# Altium project Sumobot 2007.PRJPCB
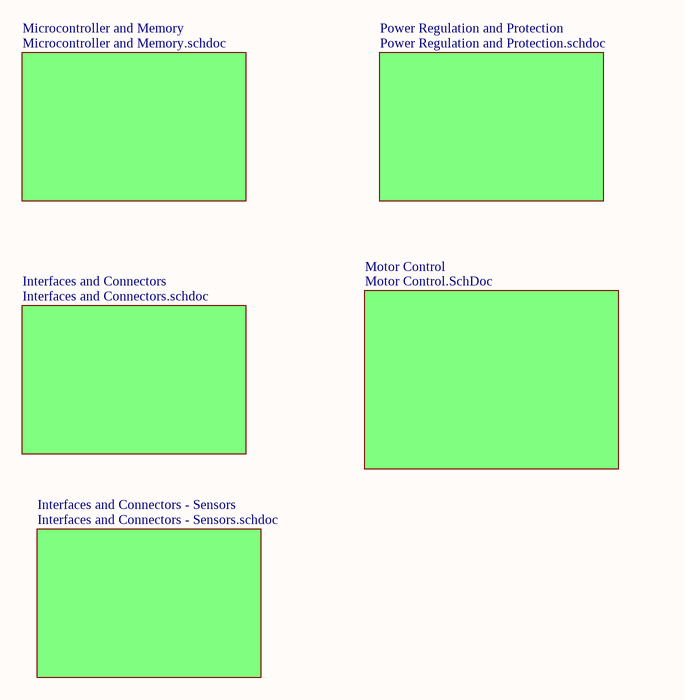
[diagram p0: Schematic of Schematics.SCHDOC]
6 sheets, 186 parts. Net scope: global (net labels, ports and power ports of the same name join across sheets).
Board files: PCB Layout.PCBDOC, SumoPCB.PcbDoc
Sheets:
  Schematic of Schematics.SCHDOC
    Microcontroller and Memory = Microcontroller and Memory.SCHDOC
    Interfaces and Connectors = Interfaces and Connectors.SCHDOC
    Power Regulation and Protection = Power Regulation and Protection.SCHDOC
    Motor Control = Motor Control.SchDoc
    Interfaces and Connectors - Sensors = Interfaces and Connectors - Sensors.SCHDOC

## Sheet Schematic of Schematics.SCHDOC
size A4

### Sub-sheets
Interfaces and Connectors = Interfaces and Connectors.schdoc: no entries
Interfaces and Connectors - Sensors = Interfaces and Connectors - Sensors.schdoc: no entries
Microcontroller and Memory = Microcontroller and Memory.schdoc: no entries
Motor Control = Motor Control.SchDoc: no entries
Power Regulation and Protection = Power Regulation and Protection.schdoc: no entries

## Sheet Microcontroller and Memory.SCHDOC
size A3; SheetNumber: 1; SheetTotal: 5
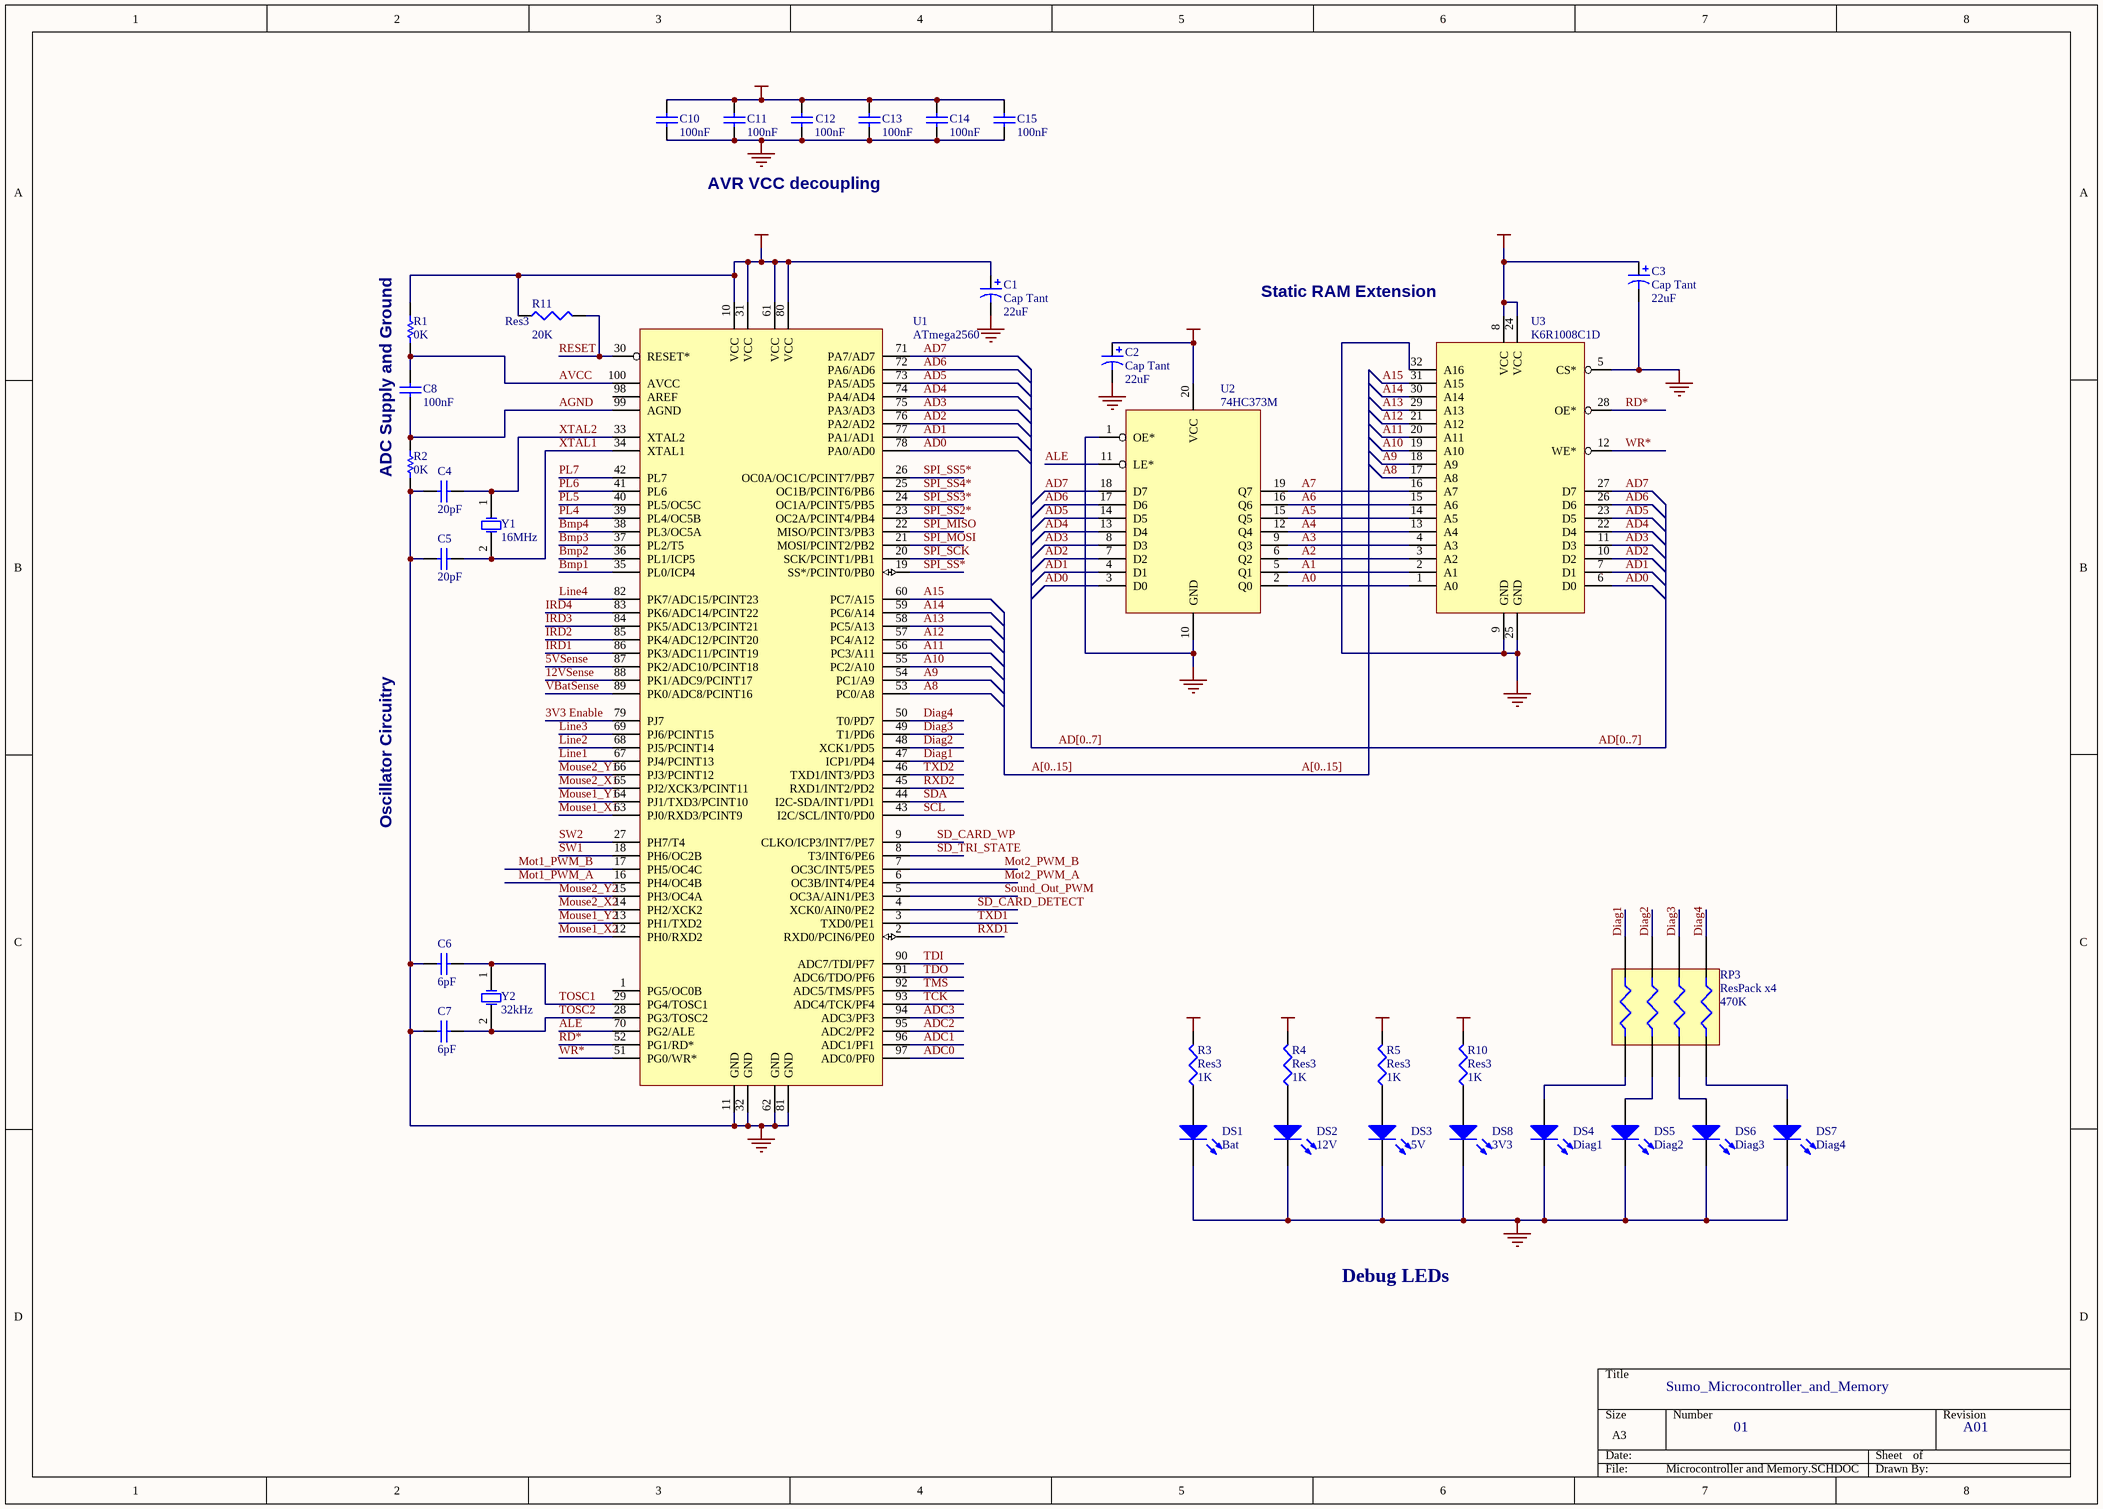
[diagram p1: Microcontroller and Memory.SCHDOC]

### Parts
C1  Cap Tant  value 22uF  [CAPR5-4X5]
C2  Cap Tant  value 22uF  [CAPR5-4X5]
C3  Cap Tant  value 22uF  [CAPR5-4X5]
C4  20pF  [CC2012-0805]
C5  20pF  [CC2012-0805]
C6  6pF  [CC2012-0805]
C7  6pF  [CC2012-0805]
C8  100nF  [CC2012-0805]
C10  value 100nF  [CC2012-0805]  (hidden comment: Cap Semi)
C11  value 100nF  [CC2012-0805]  (hidden comment: Cap Semi)
C12  value 100nF  [CC2012-0805]  (hidden comment: Cap Semi)
C13  value 100nF  [CC2012-0805]  (hidden comment: Cap Semi)
C14  value 100nF  [CC2012-0805]  (hidden comment: Cap Semi)
C15  value 100nF  [CC2012-0805]  (hidden comment: Cap Semi)
DS1  Bat  [SMD _LED]
DS2  12V  [SMD _LED]
DS3  5V  [SMD _LED]
DS4  Diag1  [SMD _LED]
DS5  Diag2  [SMD _LED]
DS6  Diag3  [SMD _LED]
DS7  Diag4  [SMD _LED]
DS8  3V3  [SMD _LED]
R1  0K  [AXIAL-0.3]
R2  0K  [AXIAL-0.3]
R3  Res3  value 1K  [R2012-0805]
R4  Res3  value 1K  [R2012-0805]
R5  Res3  value 1K  [R2012-0805]
R10  Res3  value 1K  [R2012-0805]
R11  Res3  value 20K  [R2012-0805]
RP3  ResPack x4  value 470K  [4x0603 Resistor pack]
U1  ATmega2560  [F-QFP14X14-G100/Z17N]
U2  74HC373M  [SO-G20/Y1.45]
U3  K6R1008C1D  [SO-G32/Y1.45]
Y1  16MHz  [Crystal HC49SLF]
Y2  32kHz  [Crystal CFS206]

### Nets
3V3: R10.2
5V: C1.1 C2.1 C3.1 C10.2 C11.2 C12.2 C13.2 C14.2 C15.2 R1.2 R5.2 R11.1 U1.10(VCC) U1.31(VCC) U1.61(VCC) U1.80(VCC) U2.20(VCC) U3.8(VCC) U3.24(VCC)
12V: R4.2
GND: C1.2 C2.2 C3.2 C4.1 C5.1 C6.1 C7.1 C10.1 C11.1 C12.1 C13.1 C14.1 C15.1 DS1.2(K) DS2.2(K) DS3.2(K) DS4.2(K) DS5.2(K) DS6.2(K) DS7.2(K) DS8.2(K) R2.1 U1.11(GND) U1.32(GND) U1.62(GND) U1.81(GND) U2.1(OE*) U2.10(GND) U3.5(CS*) U3.9(GND) U3.25(GND) U3.32(A16)
VBat: R3.2
3V3 Enable: U1.79(PJ7)
5VSense: U1.87(PK2/ADC10/PCINT18)
12VSense: U1.88(PK1/ADC9/PCINT17)
A0: U2.2(Q0) U3.1(A0)
A1: U2.5(Q1) U3.2(A1)
A2: U2.6(Q2) U3.3(A2)
A3: U2.9(Q3) U3.4(A3)
A4: U2.12(Q4) U3.13(A4)
A5: U2.15(Q5) U3.14(A5)
A6: U2.16(Q6) U3.15(A6)
A7: U2.19(Q7) U3.16(A7)
A8: U1.53(PC0/A8) U3.17(A8)
A9: U1.54(PC1/A9) U3.18(A9)
A10: U1.55(PC2/A10) U3.19(A10)
A11: U1.56(PC3/A11) U3.20(A11)
A12: U1.57(PC4/A12) U3.21(A12)
A13: U1.58(PC5/A13) U3.29(A13)
A14: U1.59(PC6/A14) U3.30(A14)
A15: U1.60(PC7/A15) U3.31(A15)
AD0: U1.78(PA0/AD0) U2.3(D0) U3.6(D0)
AD1: U1.77(PA1/AD1) U2.4(D1) U3.7(D1)
AD2: U1.76(PA2/AD2) U2.7(D2) U3.10(D2)
AD3: U1.75(PA3/AD3) U2.8(D3) U3.11(D3)
AD4: U1.74(PA4/AD4) U2.13(D4) U3.22(D4)
AD5: U1.73(PA5/AD5) U2.14(D5) U3.23(D5)
AD6: U1.72(PA6/AD6) U2.17(D6) U3.26(D6)
AD7: U1.71(PA7/AD7) U2.18(D7) U3.27(D7)
ADC0: U1.97(ADC0/PF0)
ADC1: U1.96(ADC1/PF1)
ADC2: U1.95(ADC2/PF2)
ADC3: U1.94(ADC3/PF3)
AGND: C8.2 R2.2 U1.99(AGND)
ALE: U1.70(PG2/ALE) U2.11(LE*)
AVCC: C8.1 R1.1 U1.100(AVCC)
Bmp1: U1.35(PL0/ICP4)
Bmp2: U1.36(PL1/ICP5)
Bmp3: U1.37(PL2/T5)
Bmp4: U1.38(PL3/OC5A)
Diag1: RP3.8 U1.47(ICP1/PD4)
Diag2: RP3.7 U1.48(XCK1/PD5)
Diag3: RP3.6 U1.49(T1/PD6)
Diag4: RP3.5 U1.50(T0/PD7)
IRD1: U1.86(PK3/ADC11/PCINT19)
IRD2: U1.85(PK4/ADC12/PCINT20)
IRD3: U1.84(PK5/ADC13/PCINT21)
IRD4: U1.83(PK6/ADC14/PCINT22)
Line1: U1.67(PJ4/PCINT13)
Line2: U1.68(PJ5/PCINT14)
Line3: U1.69(PJ6/PCINT15)
Line4: U1.82(PK7/ADC15/PCINT23)
Mot1_PWM_A: U1.16(PH4/OC4B)
Mot1_PWM_B: U1.17(PH5/OC4C)
Mot2_PWM_A: U1.6(OC3B/INT4/PE4)
Mot2_PWM_B: U1.7(OC3C/INT5/PE5)
Mouse1_X1: U1.63(PJ0/RXD3/PCINT9)
Mouse1_X2: U1.12(PH0/RXD2)
Mouse1_Y1: U1.64(PJ1/TXD3/PCINT10)
Mouse1_Y2: U1.13(PH1/TXD2)
Mouse2_X1: U1.65(PJ2/XCK3/PCINT11)
Mouse2_X2: U1.14(PH2/XCK2)
Mouse2_Y1: U1.66(PJ3/PCINT12)
Mouse2_Y2: U1.15(PH3/OC4A)
PL4: U1.39(PL4/OC5B)
PL5: U1.40(PL5/OC5C)
PL6: U1.41(PL6)
PL7: U1.42(PL7)
RD*: U1.52(PG1/RD*) U3.28(OE*)
RESET: R11.2 U1.30(RESET*)
RXD1: U1.2(RXD0/PCIN6/PE0)
RXD2: U1.45(RXD1/INT2/PD2)
SCL: U1.43(I2C/SCL/INT0/PD0)
SD_CARD_DETECT: U1.4(XCK0/AIN0/PE2)
SD_CARD_WP: U1.9(CLKO/ICP3/INT7/PE7)
SD_TRI_STATE: U1.8(T3/INT6/PE6)
SDA: U1.44(I2C-SDA/INT1/PD1)
Sound_Out_PWM: U1.5(OC3A/AIN1/PE3)
SPI_MISO: U1.22(MISO/PCINT3/PB3)
SPI_MOSI: U1.21(MOSI/PCINT2/PB2)
SPI_SCK: U1.20(SCK/PCINT1/PB1)
SPI_SS2*: U1.23(OC2A/PCINT4/PB4)
SPI_SS3*: U1.24(OC1A/PCINT5/PB5)
SPI_SS4*: U1.25(OC1B/PCINT6/PB6)
SPI_SS5*: U1.26(OC0A/OC1C/PCINT7/PB7)
SPI_SS*: U1.19(SS*/PCINT0/PB0)
SW1: U1.18(PH6/OC2B)
SW2: U1.27(PH7/T4)
TCK: U1.93(ADC4/TCK/PF4)
TDI: U1.90(ADC7/TDI/PF7)
TDO: U1.91(ADC6/TDO/PF6)
TMS: U1.92(ADC5/TMS/PF5)
TOSC1: C6.2 U1.29(PG4/TOSC1) Y2.1(OSC1)
TOSC2: C7.2 U1.28(PG3/TOSC2) Y2.2(OSC2)
TXD1: U1.3(TXD0/PE1)
TXD2: U1.46(TXD1/INT3/PD3)
VBatSense: U1.89(PK0/ADC8/PCINT16)
WR*: U1.51(PG0/WR*) U3.12(WE*)
XTAL1: C5.2 U1.34(XTAL1) Y1.2(OSC2)
XTAL2: C4.2 U1.33(XTAL2) Y1.1(OSC1)
NetDS1_1: DS1.1(A) R3.1
NetDS2_1: DS2.1(A) R4.1
NetDS3_1: DS3.1(A) R5.1
NetDS4_1: DS4.1(A) RP3.1
NetDS5_1: DS5.1(A) RP3.2
NetDS6_1: DS6.1(A) RP3.3
NetDS7_1: DS7.1(A) RP3.4
NetDS8_1: DS8.1(A) R10.1

Not connected (* = marked no-connect by the designer): U1 1(PG5/OC0B) 98(AREF)

### Buses and harness runs
bus A[0..15]
bus AD[0..7]

### Notes on the sheet
- AVR VCC decoupling
- (near U3) Static RAM Extension
- ADC Supply and Ground
- Oscillator Circuitry
- Debug LEDs
- Sumo_Microcontroller_and_Memory
- 01
- A01

### Library data of the parts
C1-C3 = Cap Pol2: Polarized Capacitor (Axial); Published: 8-Jun-2000; Revision: July-2002: Re-released for DXP Platform.; Publisher: Altium Limited
C4-C8 = Cap: Capacitor; Published: 8-Jun-2000; Revision: July-2002: Re-released for DXP Platform.; Publisher: Altium Limited
C10-C15 = Cap Semi: Capacitor (Semiconductor SIM Model); Published: 8-Jun-2000; Revision: July-2002: Re-released for DXP Platform.; Publisher: Altium Limited
DS1-DS8 = LED3: Typical BLUE SiC LED; Revision 1: Jul-2002: Re-released for DXP Platform.; Revision 2: 17-Dec-2003: PCB Footprint replaced.; Published: 8-Jun-2000; Publisher: Altium Limited
R1 R2 = Res1: Resistor; Published: 8-Jun-2000; Revision: July-2002: Re-released for DXP Platform.; Publisher: Altium Limited
R3-R5 R10 R11 = Res3: Resistor; Published: 8-Jun-2000; Revision: July-2002: Re-released for DXP Platform.; Publisher: Altium Limited
U1 = ATmega2560: Atmel ATmega2560 MCU
U2 = 74373: Octal 8-bit D-type Latch
U3 = K6R1008C1D: Samsung 128Kx8 High-Speed Static RAM
Y1 Y2 = XTAL: Crystal Oscillator; Published: 8-Jun-2000; Revision: July-2002: Re-released for DXP Platform.; Publisher: Altium Limited

## Sheet Interfaces and Connectors.SCHDOC
size A4
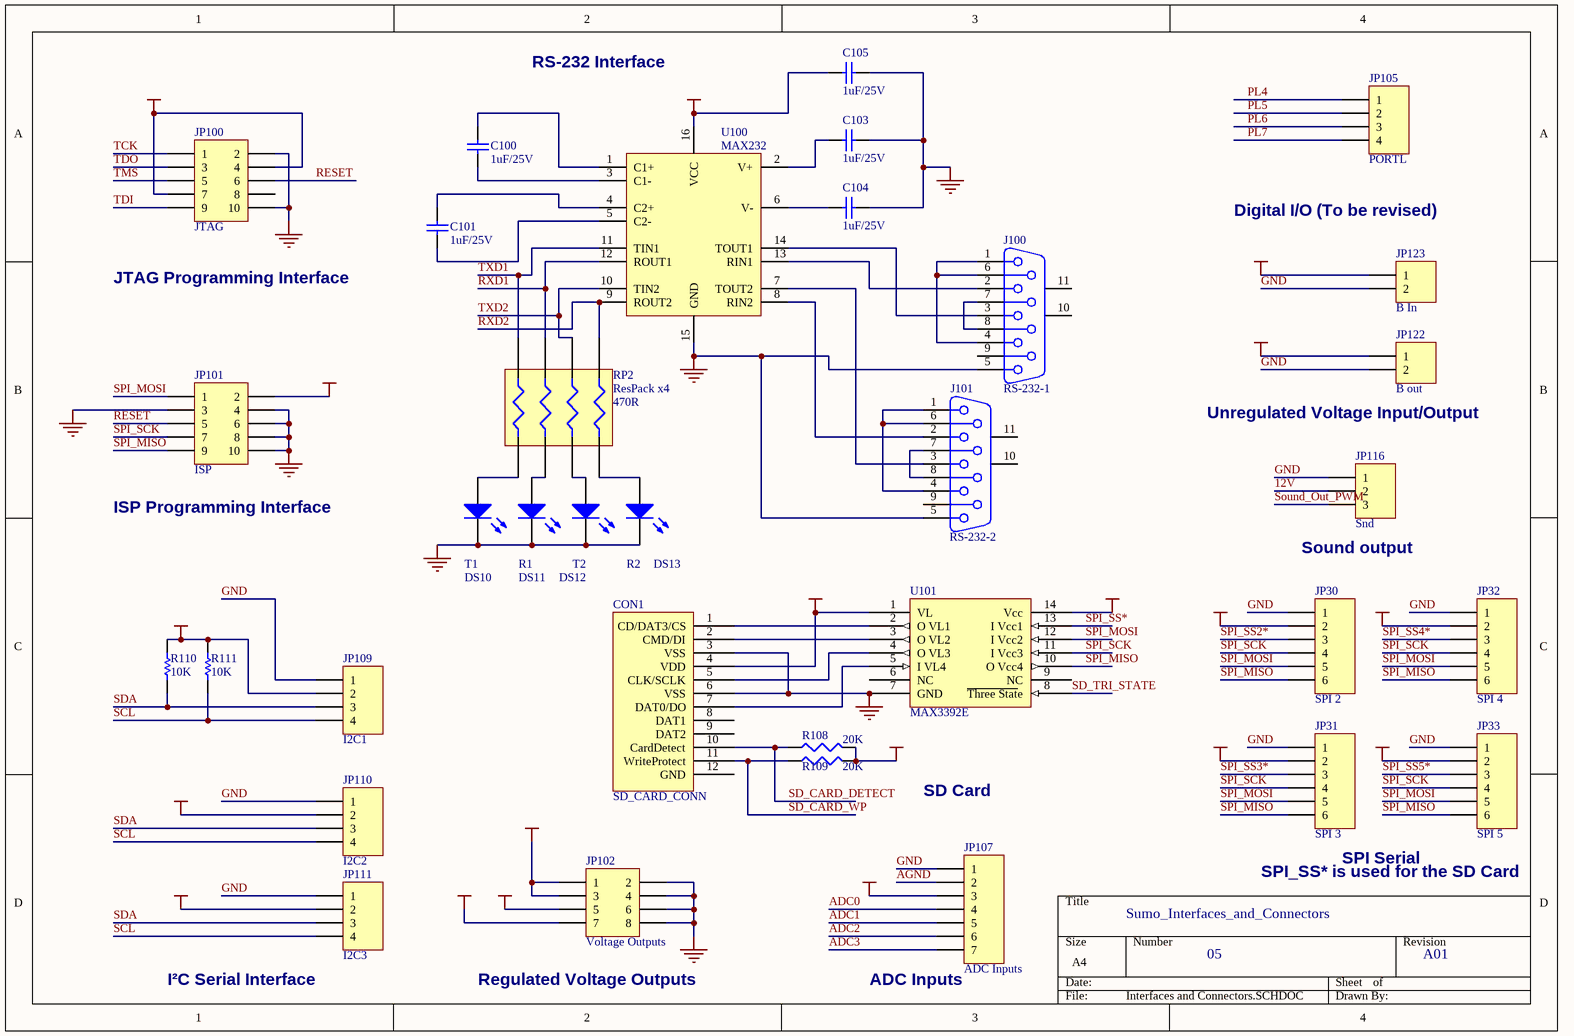
[diagram p2: Interfaces and Connectors.SCHDOC]

### Parts
C100  value 1uF/25V  [CC2012-0805]  (hidden comment: Cap Semi)
C101  value 1uF/25V  [CC2012-0805]  (hidden comment: Cap Semi)
C103  value 1uF/25V  [CC2012-0805]  (hidden comment: Cap Semi)
C104  value 1uF/25V  [CC2012-0805]  (hidden comment: Cap Semi)
C105  value 1uF/25V  [CC2012-0805]  (hidden comment: Cap Semi)
CON1  SD_CARD_CONN  [SD Card AVX]
DS10  T1  [SMD _LED]
DS11  R1  [SMD _LED]
DS12  T2  [SMD _LED]
DS13  R2  [SMD _LED]
J100  RS-232-1  [DSUB1.385-2H9 Simple]
J101  RS-232-2  [DSUB1.385-2H9 Simple]
JP30  SPI 2  [ZHR 1x6 1.5mm]
JP31  SPI 3  [ZHR 1x6 1.5mm]
JP32  SPI 4  [ZHR 1x6 1.5mm]
JP33  SPI 5  [ZHR 1x6 1.5mm]
JP100  JTAG  [HDR2X5]
JP101  ISP  [HDR2X5]
JP102  Voltage Outputs  [microfit 2x4 3mm]
JP105  PORTL  [EHR 1x4 2.5mm]
JP107  ADC Inputs  [KK 1x7 2.54mm]
JP109  I2C1  [ZHR 1x4 1.5mm]
JP110  I2C2  [ZHR 1x4 1.5mm]
JP111  I2C3  [ZHR 1x4 1.5mm]
JP116  Snd  [KK 1x3 2.54mm]
JP122  B out  [Mini-Fit Jnr 2x1 4.2mm]
JP123  B In  [Mini-Fit Jnr 2x1 4.2mm]
R108  value 20K  [CR2012-0805]  (hidden comment: Res3)
R109  value 20K  [CR2012-0805]  (hidden comment: Res3)
R110  10K  [CR2012-0805]
R111  10K  [CR2012-0805]
RP2  ResPack x4  value 470R  [4x0603 Resistor pack]
U100  MAX232  [SO-G16/C5.85]
U101  MAX3392E  [TSSOP14]

### Nets
3V3: CON1.4(VDD) JP102.7 U101.1(VL)
5V: C105.1 JP30.2 JP31.2 JP32.2 JP33.2 JP100.4 JP100.7 JP101.2 JP102.5 JP107.3 JP109.2 JP110.2 JP111.2 R108.2 R109.2 R110.2 R111.2 U100.16(VCC) U101.14(Vcc)
12V: JP102.1 JP102.3 JP116.2
GND: C103.2 C104.2 C105.2 CON1.3(VSS) CON1.6(VSS) DS10.2(K) DS11.2(K) DS12.2(K) DS13.2(K) J100.5 J101.5 JP30.1 JP31.1 JP32.1 JP33.1 JP100.2 JP100.10 JP101.3 JP101.4 JP101.6 JP101.8 JP101.10 JP102.2 JP102.4 JP102.6 JP102.8 JP107.1 JP109.1 JP110.1 JP111.1 JP116.1 JP122.2 JP123.2 U100.15(GND) U101.7(GND)
VBat: JP122.1
VBatIn: JP123.1
ADC0: JP107.4
ADC1: JP107.5
ADC2: JP107.6
ADC3: JP107.7
AGND: JP107.2
PL4: JP105.1
PL5: JP105.2
PL6: JP105.3
PL7: JP105.4
RESET: JP100.6 JP101.5
RXD1: RP2.7 U100.12(ROUT1)
RXD2: RP2.5 U100.9(ROUT2)
SCL: JP109.4 JP110.4 JP111.4 R111.1
SD_CARD_DETECT: CON1.10(CardDetect) R108.1
SD_CARD_WP: CON1.11(WriteProtect) R109.1
SD_TRI_STATE: U101.8(~{Three_Stat}e)
SDA: JP109.3 JP110.3 JP111.3 R110.1
Sound_Out_PWM: JP116.3
SPI_MISO: JP30.6 JP31.6 JP32.6 JP33.6 JP101.9 U101.10(O_Vcc4)
SPI_MOSI: JP30.5 JP31.5 JP32.5 JP33.5 JP101.1 U101.12(I_Vcc2)
SPI_SCK: JP30.4 JP31.4 JP32.4 JP33.4 JP101.7 U101.11(I_Vcc3)
SPI_SS2*: JP30.3
SPI_SS3*: JP31.3
SPI_SS4*: JP32.3
SPI_SS5*: JP33.3
SPI_SS*: U101.13(I_Vcc1)
TCK: JP100.1
TDI: JP100.9
TDO: JP100.3
TMS: JP100.5
TXD1: RP2.8 U100.11(TIN1)
TXD2: RP2.6 U100.10(TIN2)
NetC100_1: C100.1 U100.3(C1-)
NetC100_2: C100.2 U100.1(C1+)
NetC101_1: C101.1 U100.5(C2-)
NetC101_2: C101.2 U100.4(C2+)
NetC103_1: C103.1 U100.2(V+)
NetC104_1: C104.1 U100.6(V-)
NetCON1_1: CON1.1(CD/DAT3/CS) U101.2(O_VL1)
NetCON1_2: CON1.2(CMD/DI) U101.3(O_VL2)
NetCON1_5: CON1.5(CLK/SCLK) U101.4(O_VL3)
NetCON1_7: CON1.7(DAT0/DO) U101.5(I_VL4)
NetDS10_1: DS10.1(A) RP2.1
NetDS11_1: DS11.1(A) RP2.2
NetDS12_1: DS12.1(A) RP2.3
NetDS13_1: DS13.1(A) RP2.4
NetJ100_1: J100.1 J100.4 J100.6
NetJ100_2: J100.2 U100.13(RIN1)
NetJ100_3: J100.3 U100.14(TOUT1)
NetJ100_7: J100.7 J100.8
NetJ101_1: J101.1 J101.4 J101.6
NetJ101_2: J101.2 U100.8(RIN2)
NetJ101_3: J101.3 U100.7(TOUT2)
NetJ101_7: J101.7 J101.8

Not connected (* = marked no-connect by the designer): CON1 8(DAT1) 9(DAT2) 12(GND); J100 9 10(MH1) 11(MH2); J101 9 10(MH1) 11(MH2); JP100 8; U101 6(NC) 9(NC)

### Notes on the sheet
- RS-232 Interface
- Digital I/O (To be revised)
- JTAG Programming Interface
- Unregulated Voltage Input/Output
- (near JP101) ISP Programming Interface
- Sound output
- SD Card
- Sumo_Interfaces_and_Connectors
- SPI_SS* is used for the SD Card
- SPI Serial
- (near JP111) I²C Serial Interface
- (near JP102) Regulated Voltage Outputs
- (near JP107) ADC Inputs
- 05
- A01

### Library data of the parts
C100 C101 C103-C105 = Cap Semi: Capacitor (Semiconductor SIM Model); Published: 8-Jun-2000; Revision: July-2002: Re-released for DXP Platform.; Publisher: Altium Limited
DS10-DS13 = LED3: as DS1 on sheet Microcontroller and Memory; Published: 8-Jun-2000; Publisher: Altium Limited
J100 J101 = D Connector 9: Receptacle Assembly, 9 Position, Right Angle; Package Information: Latest Revision: O; Positions: 9; Published: 15-Jun-2001; Revision: 17-Jul-2002: Re-released for DXP Platform.; Datasheet: (1-Sep-1999); Package Reference: 788750; Publisher: Altium Limited; Orientation: Right Angle; Gender: Receptacle
JP30-JP33 = Header 6: Header, 6-Pin; Revision: 17-Jul-2002: Re-released for DXP Platform.; Publisher: Altium Limited
JP100 JP101 = Header 5X2: Header, 5-Pin, Dual row; Revision: 17-Jul-2002: Re-released for DXP Platform.; Publisher: Altium Limited
JP102 = Header 4X2: Header, 4-Pin, Dual row; Revision: 17-Jul-2002: Re-released for DXP Platform.; Publisher: Altium Limited
JP105 JP109-JP111 = Header 4: Header, 4-Pin; Revision: 17-Jul-2002: Re-released for DXP Platform.; Publisher: Altium Limited
JP107 = Header 7: Header, 7-Pin; Revision: 17-Jul-2002: Re-released for DXP Platform.; Publisher: Altium Limited
JP116 = Header 3: Header, 3-Pin; Revision: 17-Jul-2002: Re-released for DXP Platform.; Publisher: Altium Limited
JP122 JP123 = Header 2: Header, 2-Pin; Revision: 17-Jul-2002: Re-released for DXP Platform.; Publisher: Altium Limited
R108 R109 = Res3: Resistor; Published: 8-Jun-2000; Revision: July-2002: Re-released for DXP Platform.; Publisher: Altium Limited
R110 R111 = Res1: Resistor; Published: 8-Jun-2000; Revision: July-2002: Re-released for DXP Platform.; Publisher: Altium Limited
U100 = MAX232: Maxim RS-232 Transceiver

## Sheet Power Regulation and Protection.SCHDOC
size A4
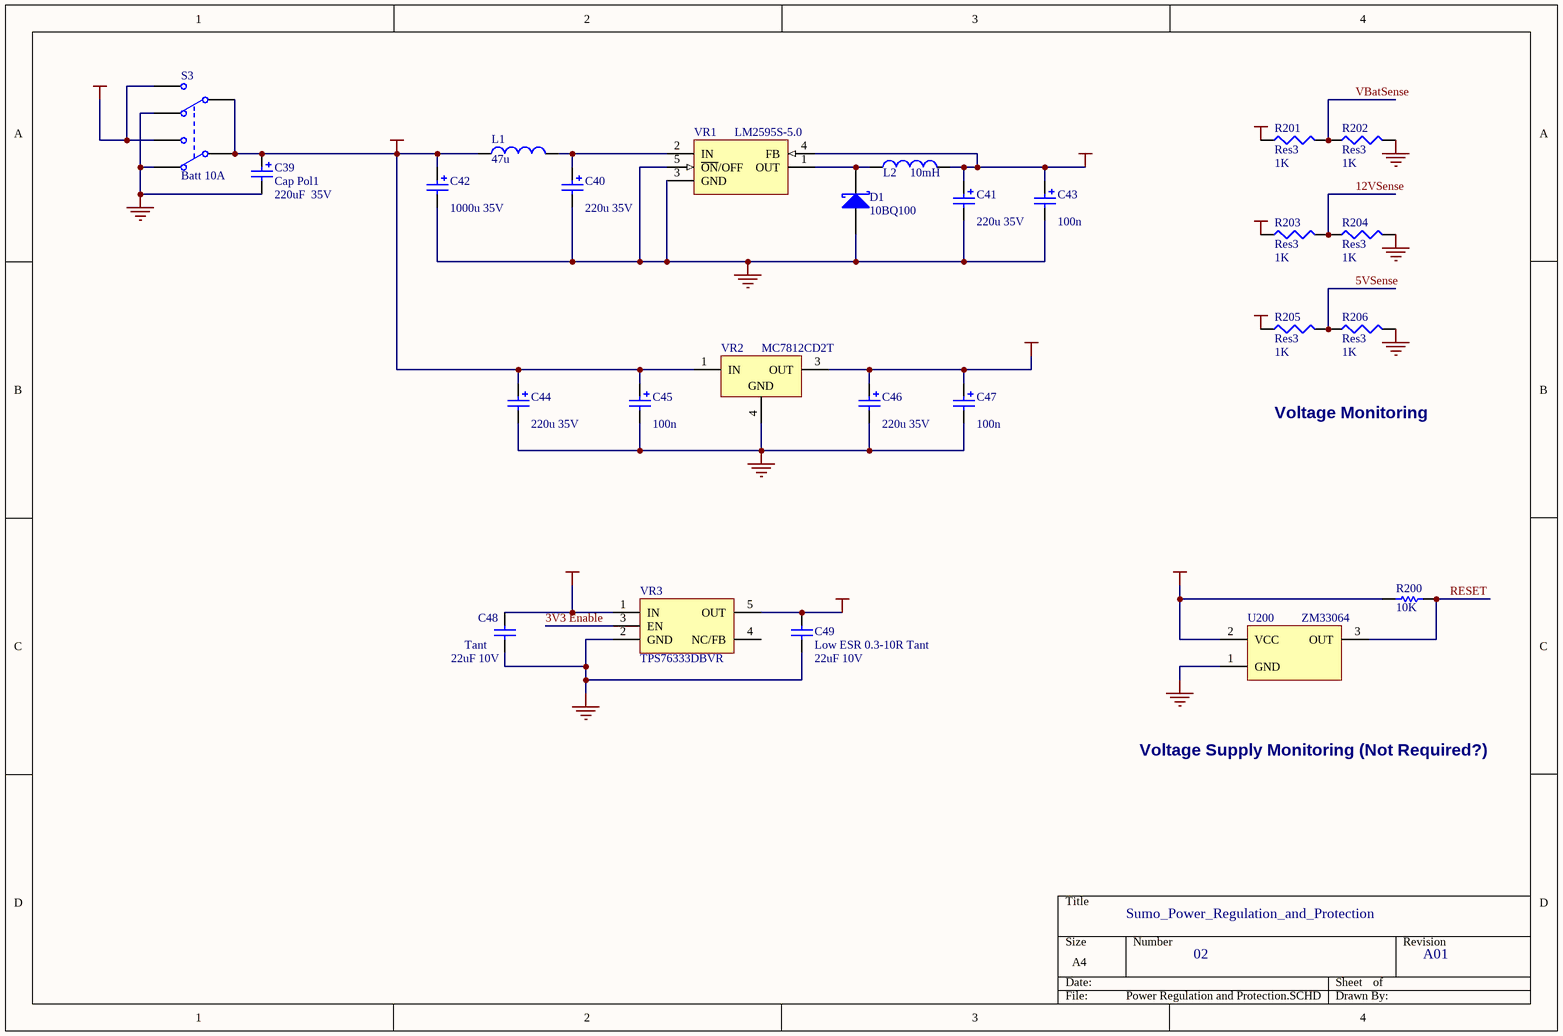
[diagram p3: Power Regulation and Protection.SCHDOC]

### Parts
C39  Cap Pol1  value 220uF  35V  [CAPPOL5-10X13]
C40  value 220u 35V  [CAPPOL5-10X13]  (hidden comment: Cap Pol1)
C41  value 220u 35V  [CAPPOL5-10X13]  (hidden comment: Cap Pol1)
C42  value 1000u 35V  [CAPPOL7.5-16]  (hidden comment: Cap Pol1)
C43  value 100n  [CC2012-0805]  (hidden comment: Cap Pol3)
C44  value 220u 35V  [CAPPOL5-10X13]  (hidden comment: Cap Pol1)
C45  value 100n  [CC2012-0805]  (hidden comment: Cap Pol3)
C46  value 220u 35V  [CAPPOL5-10X13]  (hidden comment: Cap Pol1)
C47  value 100n  [CC2012-0805]  (hidden comment: Cap Pol3)
C48  Tant  value 22uF 10V  [CC4532-1812]
C49  Low ESR 0.3-10R Tant  value 22uF 10V  [CC4532-1812]
D1  10BQ100  [SMB]
L1  value 47u  [C1005-0402]  (hidden comment: Inductor)
L2  value 10mH  [C1005-0402]  (hidden comment: Inductor)
R200  10K  [R2012-0805]
R201  Res3  value 1K  [R2012-0805]
R202  Res3  value 1K  [R2012-0805]
R203  Res3  value 1K  [R2012-0805]
R204  Res3  value 1K  [R2012-0805]
R205  Res3  value 1K  [R2012-0805]
R206  Res3  value 1K  [R2012-0805]
S3  Batt 10A  [SW  DPDT]
U200  ZM33064  [BCY-W3]
VR1  LM2595S-5.0  [TO-263 5 Pin SMT]
VR2  MC7812CD2T  [936-03]
VR3  TPS76333DBVR  [SOT-23-5]

### Nets
3V3: C49.2 VR3.5(OUT)
5V: C41.1 C43.1 C48.2 L2.2 R200.2 R205.1 U200.2(VCC) VR1.4(FB) VR3.1(IN)
12V: C46.1 C47.1 R203.1 VR2.3(OUT)
GND: C39.2 C40.2 C41.2 C42.2 C43.2 C44.2 C45.2 C46.2 C47.2 C48.1 C49.1 D1.1(A) R202.2 R204.2 R206.2 S3.1(NC1) S3.4(NC2) U200.1(GND) VR1.3(GND) VR1.5(~{ON}/OFF) VR2.4(GND) VR3.2(GND)
VBat: C39.1 C42.1 C44.1 C45.1 L1.1 R201.1 S3.2(COMMON1) S3.5(COMMON2) VR2.1(IN)
VBatIn: S3.3(NO1) S3.6(NO2)
3V3 Enable: VR3.3(EN)
5VSense: R205.2 R206.1
12VSense: R203.2 R204.1
RESET: R200.1 U200.3(OUT)
VBatSense: R201.2 R202.1
NetC40_1: C40.1 L1.2 VR1.2(IN)
NetD1_2: D1.2(K) L2.1 VR1.1(OUT)

Not connected (* = marked no-connect by the designer): VR3 4(NC/FB)

### Notes on the sheet
- Voltage Monitoring
- Voltage Supply Monitoring (Not Required?)
- Sumo_Power_Regulation_and_Protection
- 02
- A01

### Library data of the parts
C39-C42 C44 C46 = Cap Pol1: Polarized Capacitor (Radial); Published: 8-Jun-2000; Revision: July-2002: Re-released for DXP Platform.; Publisher: Altium Limited
C43 C45 C47 = Cap Pol3: Polarized Capacitor (Surface Mount); Published: 8-Jun-2000; Revision: July-2002: Re-released for DXP Platform.; Publisher: Altium Limited
C48 C49 = Cap Semi: Capacitor (Semiconductor SIM Model); Published: 8-Jun-2000; Revision: July-2002: Re-released for DXP Platform.; Publisher: Altium Limited
D1 = 10BQ100: Schottky Rectifier; Revision 1: 10-Jul-2000: SIM Model Added.; Revision 2: 17-Jul-2002: Re-released for DXP Platform.; Published: 8-Jun-2000; Datasheet: Latest Revision: PD-2.437A; Package Reference: SMB; Publisher: Altium Limited
R200 = Res1: Resistor; Published: 8-Jun-2000; Revision: July-2002: Re-released for DXP Platform.; Publisher: Altium Limited
R201-R206 = Res3: Resistor; Published: 8-Jun-2000; Revision: July-2002: Re-released for DXP Platform.; Publisher: Altium Limited
S3 = SW DPDT: Switch; Published: 24-Mar-1999; Revision: July-2002: Re-released for DXP Platform.; Publisher: Altium Limited
U200 = ZM33064: Generic 5V Supply Voltage Monitor
VR1 = LM2595S-5.0: Simple Switcher Power Converter 150 kHz 1A Step Down Voltage Regulator; Note: Tab is connected to GND; Published: 15-Apr-2002; Datasheet: Latest Revision: May-1999; Package Reference: TS5B; Publisher: Altium Limited
VR2 = MC7812CD2T: Three-Terminal Positive Voltage Regulator; Package Information: Latest Revision: 1997; Note: Pin 2 is electrically connected to Pin 4; Pin 2 is trimmed and not drawn;; Published: 15-Apr-2002; Datasheet: Latest Revision: 1997; Package Reference: 936-03; Publisher: Altium Limited
L1 L2 = Inductor: Published: 8-Jun-2000; Revision: July-2002: Re-released for DXP Platform.; Publisher: Altium Limited

## Sheet Motor Control.SchDoc
size A3; SheetNumber: 0; SheetTotal: 0
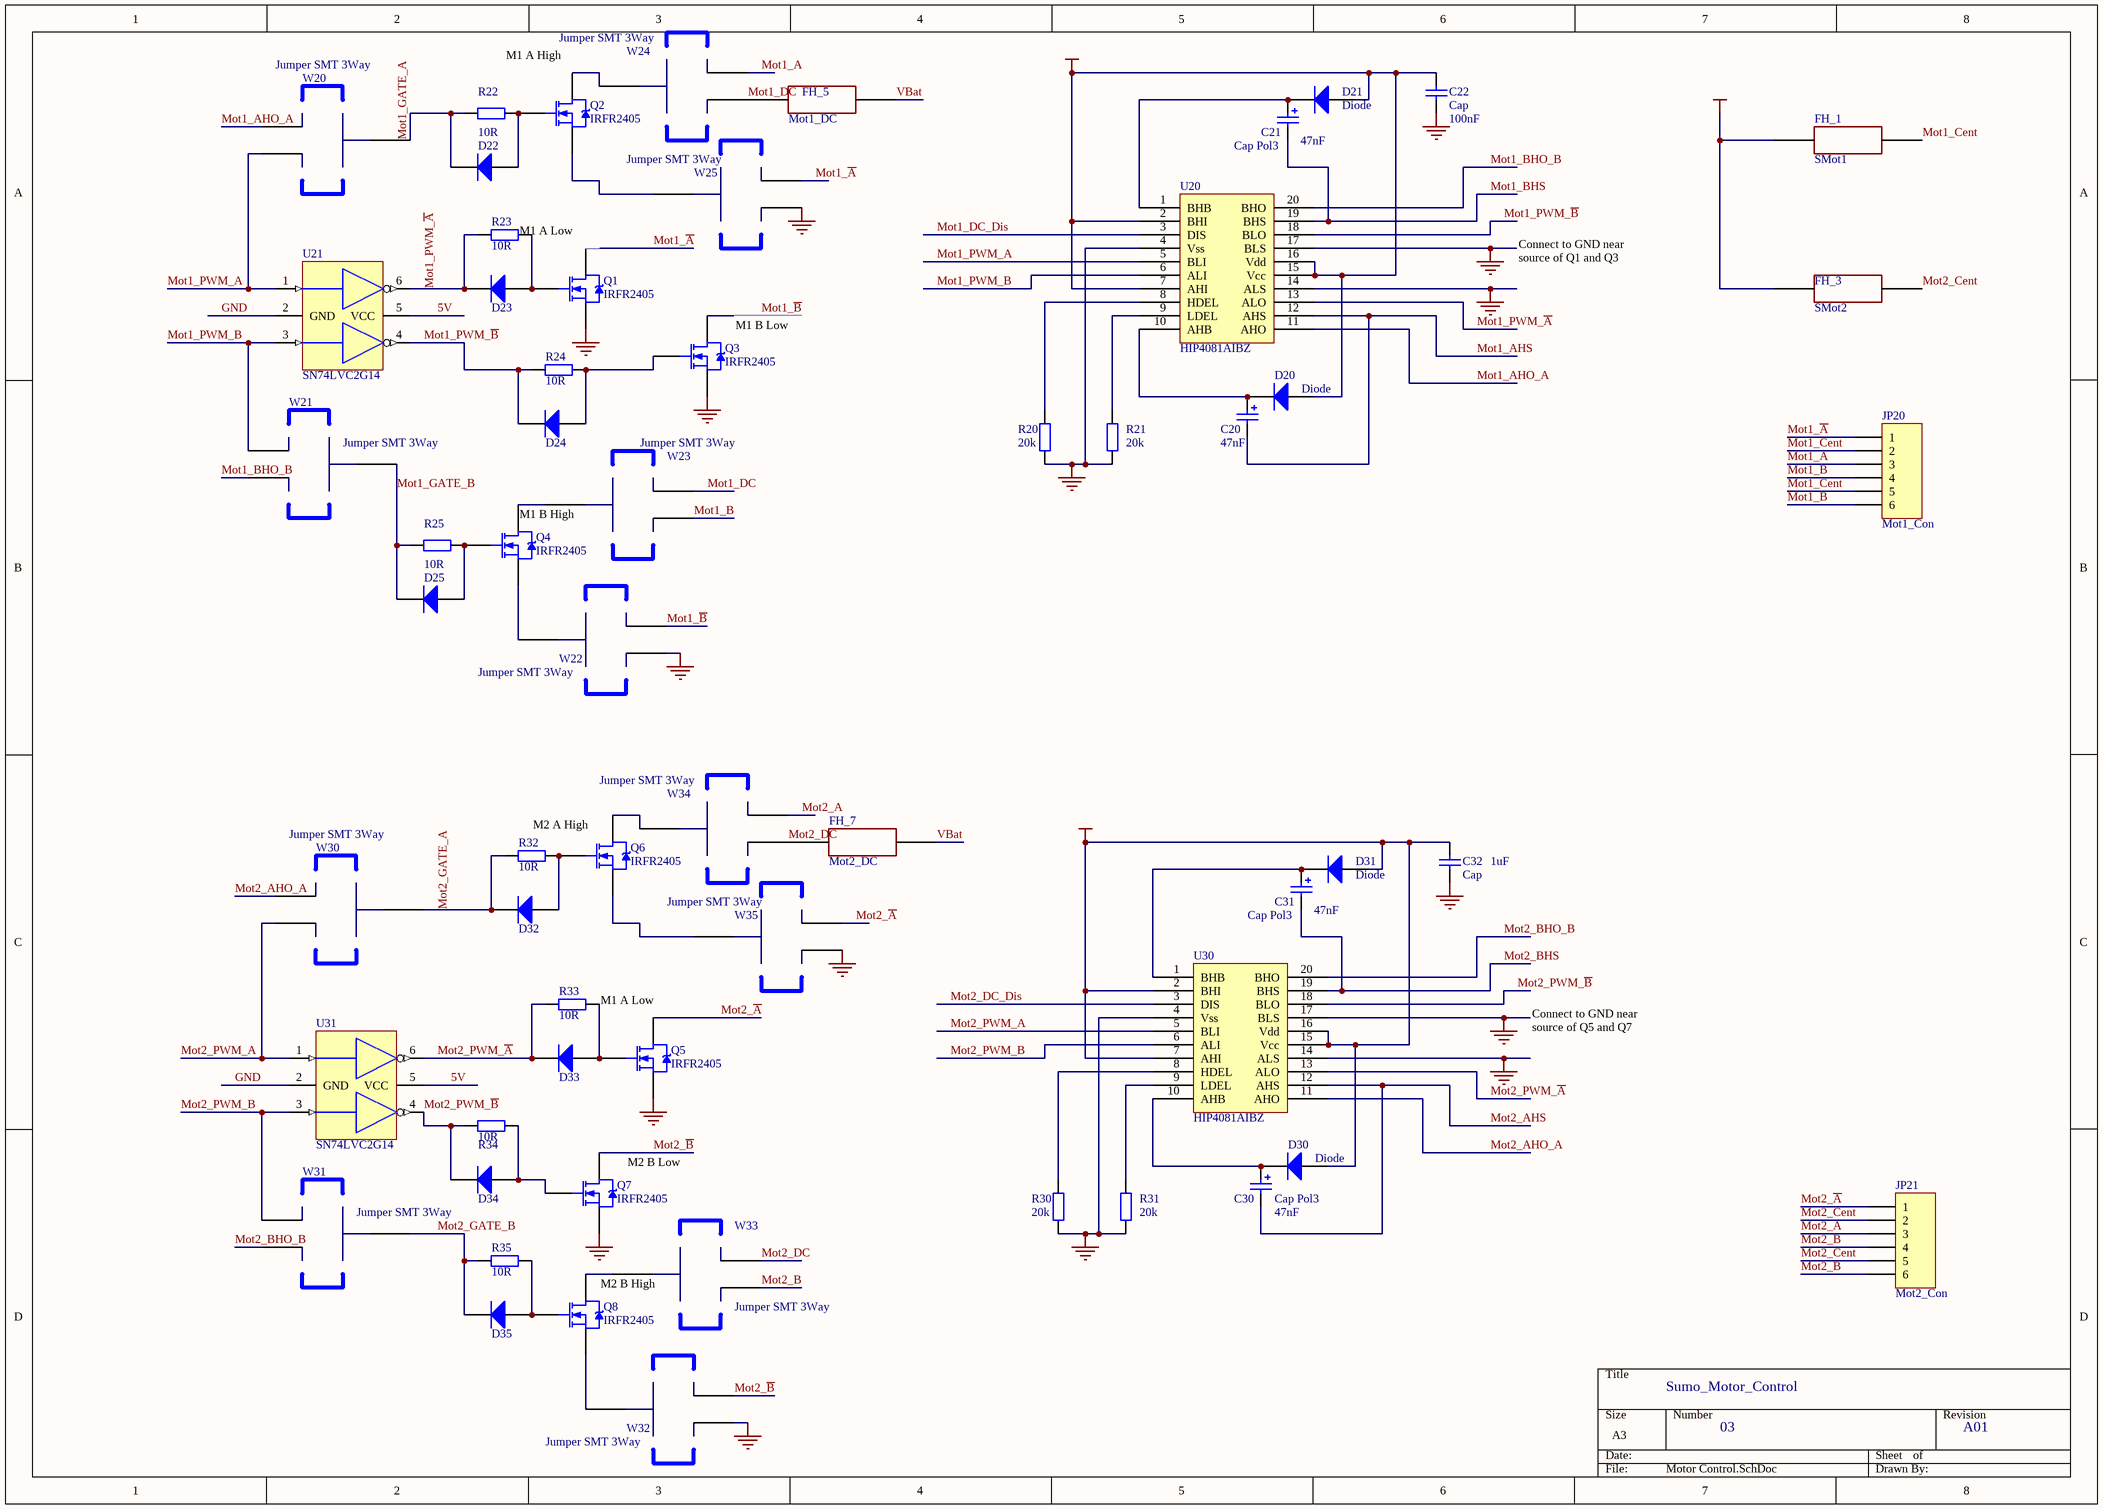
[diagram p4: Motor Control.SchDoc]

### Parts
C20  value 47nF  [CC2012-0805]  (hidden comment: Cap Pol3)
C21  Cap Pol3  value 47nF  [CC2012-0805]
C22  Cap  value 100nF  [CC2012-0805]
C30  Cap Pol3  value 47nF  [CC2012-0805]
C31  Cap Pol3  value 47nF  [CC2012-0805]
C32  Cap  value 1uF  [CC2012-0805]
D20  Diode  [SMA]
D21  Diode  [SMA]
D22  Diode  [SMA]  (value not drawn)
D23  Diode  [SMA]  (value not drawn)
D24  Diode  [SMA]  (value not drawn)
D25  Diode  [SMA]  (value not drawn)
D30  Diode  [SMA]
D31  Diode  [SMA]
D32  Diode  [SMA]  (value not drawn)
D33  Diode  [SMA]  (value not drawn)
D34  Diode  [SMA]  (value not drawn)
D35  Diode  [SMA]  (value not drawn)
FH_1  SMot1  [FuseHolder Miniblade]
FH_3  SMot2  [FuseHolder Miniblade]
FH_5  Mot1_DC  [FuseHolder Miniblade]
FH_7  Mot2_DC  [FuseHolder Miniblade]
JP20  Mot1_Con  [microfit 2x3 3mm]
JP21  Mot2_Con  [microfit 2x3 3mm]
Q1  IRFR2405  [TO-252AA]
Q2  IRFR2405  [TO-252AA]
Q3  IRFR2405  [TO-252AA]
Q4  IRFR2405  [TO-252AA]
Q5  IRFR2405  [TO-252AA]
Q6  IRFR2405  [TO-252AA]
Q7  IRFR2405  [TO-252AA]
Q8  IRFR2405  [TO-252AA]
R20  value 20k  [CR2012-0805]  (hidden comment: Res Semi)
R21  value 20k  [CR2012-0805]  (hidden comment: Res Semi)
R22  value 10R  [CR2012-0805]  (hidden comment: Res Semi)
R23  value 10R  [CR2012-0805]  (hidden comment: Res Semi)
R24  value 10R  [CR2012-0805]  (hidden comment: Res Semi)
R25  value 10R  [CR2012-0805]  (hidden comment: Res Semi)
R30  value 20k  [CR2012-0805]  (hidden comment: Res Semi)
R31  value 20k  [CR2012-0805]  (hidden comment: Res Semi)
R32  value 10R  [CR2012-0805]  (hidden comment: Res Semi)
R33  value 10R  [CR2012-0805]  (hidden comment: Res Semi)
R34  value 10R  [CR2012-0805]  (hidden comment: Res Semi)
R35  value 10R  [CR2012-0805]  (hidden comment: Res Semi)
U20  HIP4081AIBZ  [SOIC20A]
U21  SN74LVC2G14  [SC70]
U30  HIP4081AIBZ  [SOIC20A]
U31  SN74LVC2G14  [SC70]
W20  Jumper SMT 3Way  [Jumper SMT 3 Way]
W21  Jumper SMT 3Way  [Jumper SMT 3 Way]
W22  Jumper SMT 3Way  [Jumper SMT 3 Way]
W23  Jumper SMT 3Way  [Jumper SMT 3 Way]
W24  Jumper SMT 3Way  [Jumper SMT 3 Way]
W25  Jumper SMT 3Way  [Jumper SMT 3 Way]
W30  Jumper SMT 3Way  [Jumper SMT 3 Way]
W31  Jumper SMT 3Way  [Jumper SMT 3 Way]
W32  Jumper SMT 3Way  [Jumper SMT 3 Way]
W33  Jumper SMT 3Way  [Jumper SMT 3 Way]
W34  Jumper SMT 3Way  [Jumper SMT 3 Way]
W35  Jumper SMT 3Way  [Jumper SMT 3 Way]

### Nets
5V: U21.5(VCC) U31.5(VCC)
12V: C22.2 C32.2 D20.1(A) D21.1(A) D30.1(A) D31.1(A) U20.2(BHI) U20.7(AHI) U20.15(Vcc) U20.16(Vdd) U30.2(BHI) U30.7(AHI) U30.15(Vcc) U30.16(Vdd)
GND: C22.1 C32.1 Q1.3(S) Q3.3(S) Q5.3(S) Q7.3(S) R20.1 R21.1 R30.1 R31.1 U20.4(Vss) U20.14(ALS) U20.17(BLS) U21.2(GND) U30.4(Vss) U30.14(ALS) U30.17(BLS) U31.2(GND) W22.3(Out2) W25.3(Out2) W32.3(Out2) W35.3(Out2)
VBat: FH_1.1 FH_3.1 FH_5.2 FH_7.2
Mot1_A: JP20.3 W24.2(Out1)
Mot1_~{A}: JP20.1 Q1.4(D) W25.2(Out1)
Mot1_AHO_A: U20.11(AHO) W20.3(Out2)
Mot1_AHS: C20.2 U20.12(AHS)
Mot1_B: JP20.6 W23.3(Out2)
Mot1_~{B}: JP20.4 Q3.4(D) W22.2(Out1)
Mot1_BHO_B: U20.20(BHO) W21.2(Out1)
Mot1_BHS: C21.2 U20.19(BHS)
Mot1_Cent: FH_1.2 JP20.2 JP20.5
Mot1_DC: FH_5.1 W23.2(Out1) W24.3(Out2)
Mot1_DC_Dis: U20.3(DIS)
Mot1_GATE_A: D22.2(K) R22.1 W20.1(In)
Mot1_GATE_B: D25.2(K) R25.1 W21.1(In)
Mot1_PWM_A: U20.5(BLI) U21.1(A) W20.2(Out1)
Mot1_PWM_~{A}: D23.2(K) R23.1 U20.13(ALO) U21.6(Y)
Mot1_PWM_B: U20.6(ALI) U21.3(A) W21.3(Out2)
Mot1_PWM_~{B}: D24.2(K) R24.1 U20.18(BLO) U21.4(Y)
Mot2_A: JP21.3 W34.2(Out1)
Mot2_~{A}: JP21.1 Q5.4(D) W35.2(Out1)
Mot2_AHO_A: U30.11(AHO) W30.3(Out2)
Mot2_AHS: C30.2 U30.12(AHS)
Mot2_B: JP21.6 W33.3(Out2)
Mot2_~{B}: JP21.4 Q7.4(D) W32.2(Out1)
Mot2_BHO_B: U30.20(BHO) W31.2(Out1)
Mot2_BHS: C31.2 U30.19(BHS)
Mot2_Cent: FH_3.2 JP21.2 JP21.5
Mot2_DC: FH_7.1 W33.2(Out1) W34.3(Out2)
Mot2_DC_Dis: U30.3(DIS)
Mot2_GATE_A: D32.2(K) R32.1 W30.1(In)
Mot2_GATE_B: D35.2(K) R35.1 W31.1(In)
Mot2_PWM_A: U30.5(BLI) U31.1(A) W30.2(Out1)
Mot2_PWM_~{A}: D33.2(K) R33.1 U30.13(ALO) U31.6(Y)
Mot2_PWM_B: U30.6(ALI) U31.3(A) W31.3(Out2)
Mot2_PWM_~{B}: D34.2(K) R34.1 U30.18(BLO) U31.4(Y)
NetC20_1: C20.1 D20.2(K) U20.10(AHB)
NetC21_1: C21.1 D21.2(K) U20.1(BHB)
NetC30_1: C30.1 D30.2(K) U30.10(AHB)
NetC31_1: C31.1 D31.2(K) U30.1(BHB)
NetD22_1: D22.1(A) Q2.1(G) R22.2
NetD23_1: D23.1(A) Q1.1(G) R23.2
NetD24_1: D24.1(A) Q3.1(G) R24.2
NetD25_1: D25.1(A) Q4.1(G) R25.2
NetD32_1: D32.1(A) Q6.1(G) R32.2
NetD33_1: D33.1(A) Q5.1(G) R33.2
NetD34_1: D34.1(A) Q7.1(G) R34.2
NetD35_1: D35.1(A) Q8.1(G) R35.2
NetQ2_3: Q2.3(S) W25.1(In)
NetQ2_4: Q2.4(D) W24.1(In)
NetQ4_3: Q4.3(S) W22.1(In)
NetQ4_4: Q4.4(D) W23.1(In)
NetQ6_3: Q6.3(S) W35.1(In)
NetQ6_4: Q6.4(D) W34.1(In)
NetQ8_3: Q8.3(S) W32.1(In)
NetQ8_4: Q8.4(D) W33.1(In)
NetR20_2: R20.2 U20.8(HDEL)
NetR21_2: R21.2 U20.9(LDEL)
NetR30_2: R30.2 U30.8(HDEL)
NetR31_2: R31.2 U30.9(LDEL)

### Notes on the sheet
- M1 A High
- (near R23) M1 A Low
- Connect to GND near source of Q1 and Q3
- (near Q3) M1 B Low
- M1 B High
- (near Q6) M2 A High
- (near R33) M1 A Low
- Connect to GND near source of Q5 and Q7
- (near Q7) M2 B Low
- (near W33) M2 B High
- Sumo_Motor_Control
- 03
- A01

### Library data of the parts
C20 C21 C30 C31 = Cap Pol3: Polarized Capacitor (Surface Mount); Published: 8-Jun-2000; Revision: July-2002: Re-released for DXP Platform.; Publisher: Altium Limited
C22 C32 = Cap: Capacitor; Published: 8-Jun-2000; Revision: July-2002: Re-released for DXP Platform.; Publisher: Altium Limited
D20-D25 D30-D35 = Diode: Default Diode; Code - JEDEC: DO-214-AB; Published: 8-Jun-2000; Revision: July-2002: Re-released for DXP Platform.; Publisher: Altium Limited
FH_1 FH_3 FH_5 = Fuse_Holder: Fuse Holder
FH_7 = Fuse_Holder
JP20 JP21 = Header 6: Header, 6-Pin; Revision: 17-Jul-2002: Re-released for DXP Platform.; Publisher: Altium Limited
Q1-Q8 = IRFR2405: HEXFET Power MOSFET; Note: Pin 2 is trimmed and not drawn; Code - JEDEC: TO-252-AA; Published: 17-Sep-2003; Datasheet: Latest Revision: 1-Mar-2000; Package Reference: TO-252AA; Publisher: Altium Limited
R20-R25 R30-R35 = Res Semi: Semiconductor Resistor; Published: 8-Jun-2000; Revision: July-2002: Re-released for DXP Platform.; Publisher: Altium Limited
U20 U30 = HIP4081AIBZ: 80V/2.5A Peak, High Frequency Full Bridge FET Driver
U21 U31 = SN74LVC2G14: Dual Schmitt-Trigger Inverter; Package Information: Latest Revision: May-1999; Code - JEDEC: MO-203; Published: 8-Jun-2000; Revision: 17-Jul-2002: Re-released for DXP Platform.; Datasheet: Latest Revision: Jul-1995; Package Reference: DB014; Publisher: Altium Limited

## Sheet Interfaces and Connectors - Sensors.SCHDOC
size A4
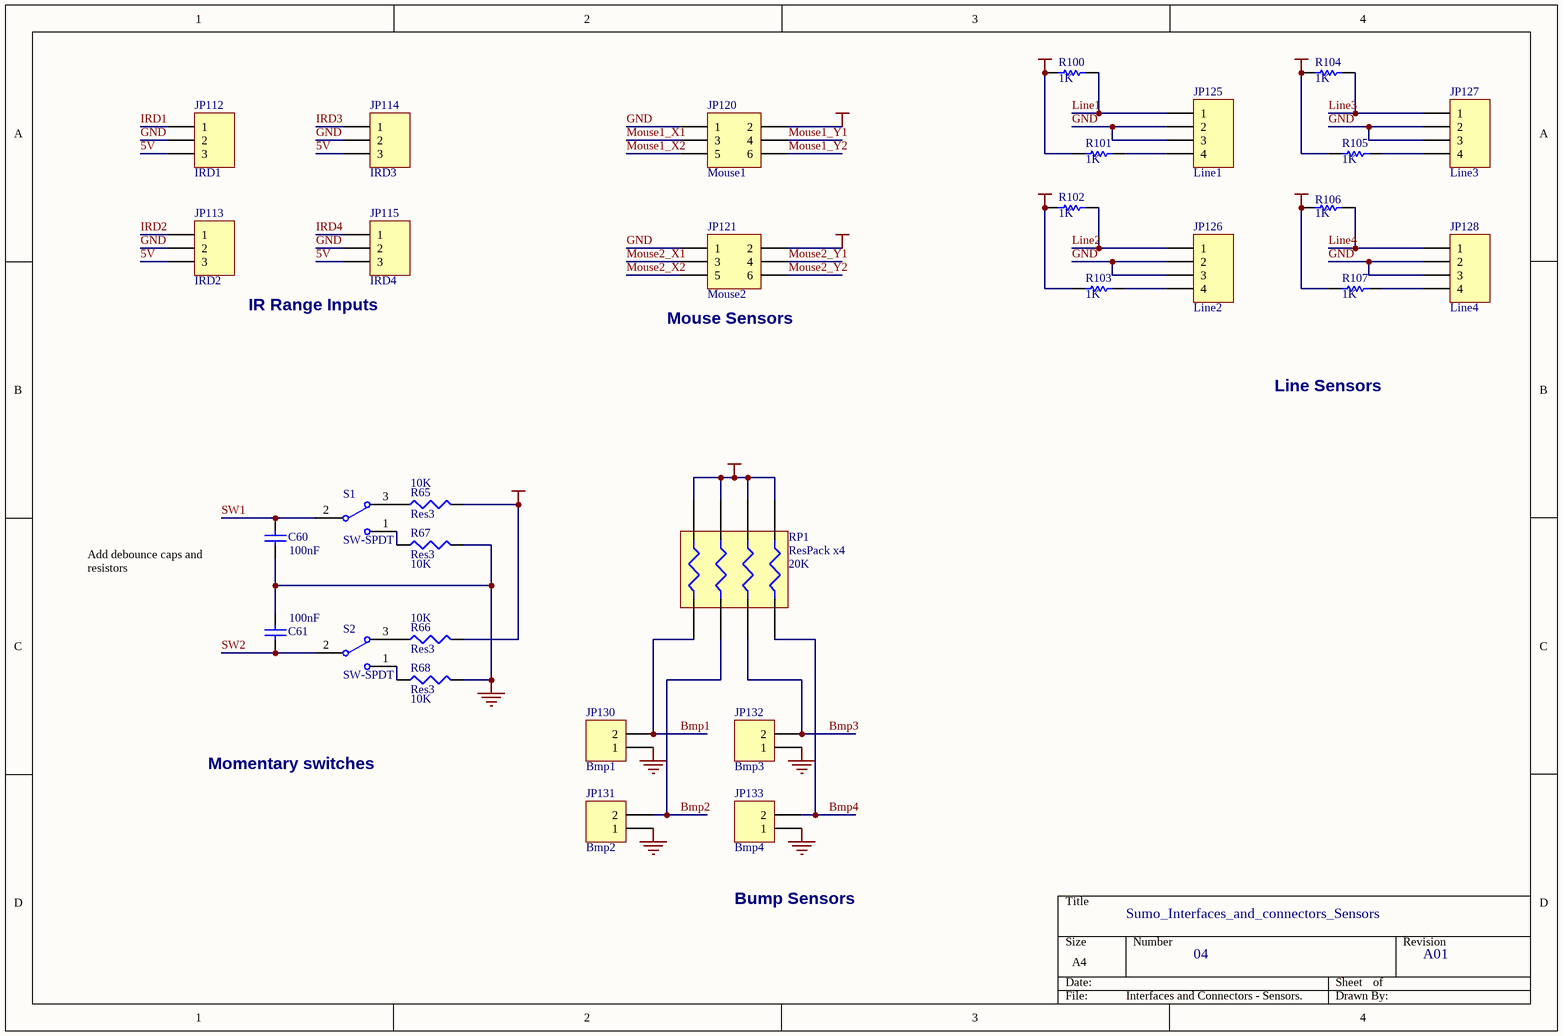
[diagram p5: Interfaces and Connectors - Sensors.SCHDOC]

### Parts
C60  value 100nF  [CR2012-0805]  (hidden comment: Cap Semi)
C61  value 100nF  [CR2012-0805]  (hidden comment: Cap Semi)
JP112  IRD1  [ZHR 1x3 1.5mm]
JP113  IRD2  [ZHR 1x3 1.5mm]
JP114  IRD3  [ZHR 1x3 1.5mm]
JP115  IRD4  [ZHR 1x3 1.5mm]
JP120  Mouse1  [PHR 1x6 2mm]
JP121  Mouse2  [PHR 1x6 2mm]
JP125  Line1  [EHR 1x4 2.5mm]
JP126  Line2  [EHR 1x4 2.5mm]
JP127  Line3  [EHR 1x4 2.5mm]
JP128  Line4  [EHR 1x4 2.5mm]
JP130  Bmp1  [KK 1x2 2.54mm]
JP131  Bmp2  [KK 1x2 2.54mm]
JP132  Bmp3  [KK 1x2 2.54mm]
JP133  Bmp4  [KK 1x2 2.54mm]
R65  Res3  value 10K  [R2012-0805]
R66  Res3  value 10K  [R2012-0805]
R67  Res3  value 10K  [R2012-0805]
R68  Res3  value 10K  [R2012-0805]
R100  value 1K  [R2012-0805]  (hidden comment: Res1)
R101  value 1K  [R2012-0805]  (hidden comment: Res1)
R102  value 1K  [R2012-0805]  (hidden comment: Res1)
R103  value 1K  [R2012-0805]  (hidden comment: Res1)
R104  value 1K  [R2012-0805]  (hidden comment: Res1)
R105  value 1K  [R2012-0805]  (hidden comment: Res1)
R106  value 1K  [R2012-0805]  (hidden comment: Res1)
R107  value 1K  [R2012-0805]  (hidden comment: Res1)
RP1  ResPack x4  value 20K  [4x0603 Resistor pack]
S1  SW-SPDT  [SW SPDT]
S2  SW-SPDT  [SW SPDT]

### Nets
5V: JP112.3 JP113.3 JP114.3 JP115.3 JP120.2 JP121.2 R65.2 R66.2 R100.1 R101.1 R102.1 R103.1 R104.1 R105.1 R106.1 R107.1 RP1.5 RP1.6 RP1.7 RP1.8
GND: C60.1 C61.2 JP112.2 JP113.2 JP114.2 JP115.2 JP120.1 JP121.1 JP125.2 JP125.3 JP126.2 JP126.3 JP127.2 JP127.3 JP128.2 JP128.3 JP130.1 JP131.1 JP132.1 JP133.1 R67.2 R68.2
Bmp1: JP130.2 RP1.1
Bmp2: JP131.2 RP1.2
Bmp3: JP132.2 RP1.3
Bmp4: JP133.2 RP1.4
IRD1: JP112.1
IRD2: JP113.1
IRD3: JP114.1
IRD4: JP115.1
Line1: JP125.1 R100.2
Line2: JP126.1 R102.2
Line3: JP127.1 R104.2
Line4: JP128.1 R106.2
Mouse1_X1: JP120.3
Mouse1_X2: JP120.5
Mouse1_Y1: JP120.4
Mouse1_Y2: JP120.6
Mouse2_X1: JP121.3
Mouse2_X2: JP121.5
Mouse2_Y1: JP121.4
Mouse2_Y2: JP121.6
SW1: C60.2 S1.2
SW2: C61.1 S2.2
NetJP125_4: JP125.4 R101.2
NetJP126_4: JP126.4 R103.2
NetJP127_4: JP127.4 R105.2
NetJP128_4: JP128.4 R107.2
NetR65_1: R65.1 S1.3
NetR66_1: R66.1 S2.3
NetR67_1: R67.1 S1.1
NetR68_1: R68.1 S2.1

### Notes on the sheet
- (near JP115) IR Range Inputs
- (near JP121) Mouse Sensors
- Line Sensors
- Add debounce caps and resistors
- Momentary switches
- Bump Sensors
- Sumo_Interfaces_and_connectors_Sensors
- 04
- A01

### Library data of the parts
C60 C61 = Cap Semi: Capacitor (Semiconductor SIM Model); Published: 8-Jun-2000; Revision: July-2002: Re-released for DXP Platform.; Publisher: Altium Limited
JP112-JP115 = MHDR1X3: Header, 3-Pin; Revision: 17-Jul-2002: Re-released for DXP Platform.; Publisher: Altium Limited
JP120 JP121 = Header 3X2: Header, 3-Pin, Dual row; Revision: 17-Jul-2002: Re-released for DXP Platform.; Publisher: Altium Limited
JP125-JP128 = Header 4H: Header, 4-Pin, Right Angle; Revision: 17-Jul-2002: Re-released for DXP Platform.; Publisher: Altium Limited
JP130-JP133 = Header 2: Header, 2-Pin; Revision: 17-Jul-2002: Re-released for DXP Platform.; Publisher: Altium Limited
R65-R68 = Res3: Resistor; Published: 8-Jun-2000; Revision: July-2002: Re-released for DXP Platform.; Publisher: Altium Limited
R100-R107 = Res1: Resistor; Published: 8-Jun-2000; Revision: July-2002: Re-released for DXP Platform.; Publisher: Altium Limited
S1 S2 = SW-SPDT: SPDT Subminiature Toggle Switch, Right Angle Mounting, Vertical Actuation; Revision 1: Jul-2002: Re-released for DXP Platform.; Revision 2: 17-Dec-2003: Schematic revised, PCB Footprint replaced.; Published: 24-Mar-1999; Datasheet: Latest Revision: 05-Dec-2000; Publisher: Altium Limited

## Nets that join several sheets
3V3: Microcontroller and Memory (R10.2), Interfaces and Connectors (CON1.4 JP102.7 U101.1), Power Regulation and Protection (C49.2 VR3.5)
5V: Microcontroller and Memory (19 pins), Interfaces and Connectors (19 pins), Power Regulation and Protection (9 pins), Motor Control (U21.5 U31.5), Interfaces and Connectors - Sensors (20 pins)
12V: Microcontroller and Memory (R4.2), Interfaces and Connectors (JP102.1 JP102.3 JP116.2), Power Regulation and Protection (C46.1 C47.1 R203.1 VR2.3), Motor Control (14 pins)
GND: Microcontroller and Memory (32 pins), Interfaces and Connectors (35 pins), Power Regulation and Protection (22 pins), Motor Control (22 pins), Interfaces and Connectors - Sensors (22 pins)
VBat: Microcontroller and Memory (R3.2), Interfaces and Connectors (JP122.1), Power Regulation and Protection (9 pins), Motor Control (FH_1.1 FH_3.1 FH_5.2 FH_7.2)
VBatIn: Interfaces and Connectors (JP123.1), Power Regulation and Protection (S3.3 S3.6)
3V3 Enable: Microcontroller and Memory (U1.79), Power Regulation and Protection (VR3.3)
5VSense: Microcontroller and Memory (U1.87), Power Regulation and Protection (R205.2 R206.1)
12VSense: Microcontroller and Memory (U1.88), Power Regulation and Protection (R203.2 R204.1)
ADC0: Microcontroller and Memory (U1.97), Interfaces and Connectors (JP107.4)
ADC1: Microcontroller and Memory (U1.96), Interfaces and Connectors (JP107.5)
ADC2: Microcontroller and Memory (U1.95), Interfaces and Connectors (JP107.6)
ADC3: Microcontroller and Memory (U1.94), Interfaces and Connectors (JP107.7)
AGND: Microcontroller and Memory (C8.2 R2.2 U1.99), Interfaces and Connectors (JP107.2)
Bmp1: Microcontroller and Memory (U1.35), Interfaces and Connectors - Sensors (JP130.2 RP1.1)
Bmp2: Microcontroller and Memory (U1.36), Interfaces and Connectors - Sensors (JP131.2 RP1.2)
Bmp3: Microcontroller and Memory (U1.37), Interfaces and Connectors - Sensors (JP132.2 RP1.3)
Bmp4: Microcontroller and Memory (U1.38), Interfaces and Connectors - Sensors (JP133.2 RP1.4)
IRD1: Microcontroller and Memory (U1.86), Interfaces and Connectors - Sensors (JP112.1)
IRD2: Microcontroller and Memory (U1.85), Interfaces and Connectors - Sensors (JP113.1)
IRD3: Microcontroller and Memory (U1.84), Interfaces and Connectors - Sensors (JP114.1)
IRD4: Microcontroller and Memory (U1.83), Interfaces and Connectors - Sensors (JP115.1)
Line1: Microcontroller and Memory (U1.67), Interfaces and Connectors - Sensors (JP125.1 R100.2)
Line2: Microcontroller and Memory (U1.68), Interfaces and Connectors - Sensors (JP126.1 R102.2)
Line3: Microcontroller and Memory (U1.69), Interfaces and Connectors - Sensors (JP127.1 R104.2)
Line4: Microcontroller and Memory (U1.82), Interfaces and Connectors - Sensors (JP128.1 R106.2)
Mot1_PWM_A: Microcontroller and Memory (U1.16), Motor Control (U20.5 U21.1 W20.2)
Mot1_PWM_B: Microcontroller and Memory (U1.17), Motor Control (U20.6 U21.3 W21.3)
Mot2_PWM_A: Microcontroller and Memory (U1.6), Motor Control (U30.5 U31.1 W30.2)
Mot2_PWM_B: Microcontroller and Memory (U1.7), Motor Control (U30.6 U31.3 W31.3)
Mouse1_X1: Microcontroller and Memory (U1.63), Interfaces and Connectors - Sensors (JP120.3)
Mouse1_X2: Microcontroller and Memory (U1.12), Interfaces and Connectors - Sensors (JP120.5)
Mouse1_Y1: Microcontroller and Memory (U1.64), Interfaces and Connectors - Sensors (JP120.4)
Mouse1_Y2: Microcontroller and Memory (U1.13), Interfaces and Connectors - Sensors (JP120.6)
Mouse2_X1: Microcontroller and Memory (U1.65), Interfaces and Connectors - Sensors (JP121.3)
Mouse2_X2: Microcontroller and Memory (U1.14), Interfaces and Connectors - Sensors (JP121.5)
Mouse2_Y1: Microcontroller and Memory (U1.66), Interfaces and Connectors - Sensors (JP121.4)
Mouse2_Y2: Microcontroller and Memory (U1.15), Interfaces and Connectors - Sensors (JP121.6)
PL4: Microcontroller and Memory (U1.39), Interfaces and Connectors (JP105.1)
PL5: Microcontroller and Memory (U1.40), Interfaces and Connectors (JP105.2)
PL6: Microcontroller and Memory (U1.41), Interfaces and Connectors (JP105.3)
PL7: Microcontroller and Memory (U1.42), Interfaces and Connectors (JP105.4)
RESET: Microcontroller and Memory (R11.2 U1.30), Interfaces and Connectors (JP100.6 JP101.5), Power Regulation and Protection (R200.1 U200.3)
RXD1: Microcontroller and Memory (U1.2), Interfaces and Connectors (RP2.7 U100.12)
RXD2: Microcontroller and Memory (U1.45), Interfaces and Connectors (RP2.5 U100.9)
SCL: Microcontroller and Memory (U1.43), Interfaces and Connectors (JP109.4 JP110.4 JP111.4 R111.1)
SD_CARD_DETECT: Microcontroller and Memory (U1.4), Interfaces and Connectors (CON1.10 R108.1)
SD_CARD_WP: Microcontroller and Memory (U1.9), Interfaces and Connectors (CON1.11 R109.1)
SD_TRI_STATE: Microcontroller and Memory (U1.8), Interfaces and Connectors (U101.8)
SDA: Microcontroller and Memory (U1.44), Interfaces and Connectors (JP109.3 JP110.3 JP111.3 R110.1)
Sound_Out_PWM: Microcontroller and Memory (U1.5), Interfaces and Connectors (JP116.3)
SPI_MISO: Microcontroller and Memory (U1.22), Interfaces and Connectors (6 pins)
SPI_MOSI: Microcontroller and Memory (U1.21), Interfaces and Connectors (6 pins)
SPI_SCK: Microcontroller and Memory (U1.20), Interfaces and Connectors (6 pins)
SPI_SS2*: Microcontroller and Memory (U1.23), Interfaces and Connectors (JP30.3)
SPI_SS3*: Microcontroller and Memory (U1.24), Interfaces and Connectors (JP31.3)
SPI_SS4*: Microcontroller and Memory (U1.25), Interfaces and Connectors (JP32.3)
SPI_SS5*: Microcontroller and Memory (U1.26), Interfaces and Connectors (JP33.3)
SPI_SS*: Microcontroller and Memory (U1.19), Interfaces and Connectors (U101.13)
SW1: Microcontroller and Memory (U1.18), Interfaces and Connectors - Sensors (C60.2 S1.2)
SW2: Microcontroller and Memory (U1.27), Interfaces and Connectors - Sensors (C61.1 S2.2)
TCK: Microcontroller and Memory (U1.93), Interfaces and Connectors (JP100.1)
TDI: Microcontroller and Memory (U1.90), Interfaces and Connectors (JP100.9)
TDO: Microcontroller and Memory (U1.91), Interfaces and Connectors (JP100.3)
TMS: Microcontroller and Memory (U1.92), Interfaces and Connectors (JP100.5)
TXD1: Microcontroller and Memory (U1.3), Interfaces and Connectors (RP2.8 U100.11)
TXD2: Microcontroller and Memory (U1.46), Interfaces and Connectors (RP2.6 U100.10)
VBatSense: Microcontroller and Memory (U1.89), Power Regulation and Protection (R201.2 R202.1)